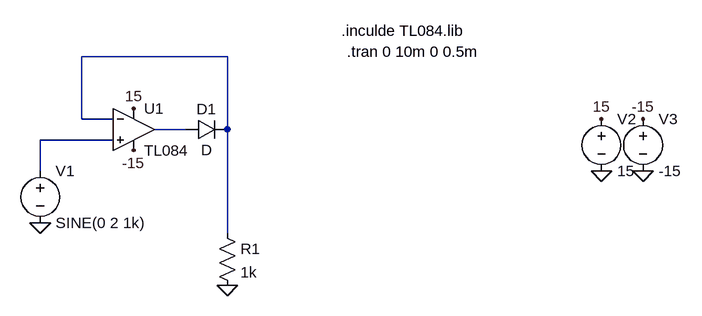
[diagram p0: schematic SuperDiode.asc]
SuperDiode.asc, the LTspice schematic file:
Version 4
SHEET 1 1072 680
WIRE 352 -48 128 -48
WIRE 128 48 128 -48
WIRE 176 48 128 48
WIRE 288 64 240 64
WIRE 352 64 352 -48
WIRE 176 80 64 80
WIRE 64 128 64 80
WIRE 352 224 352 64
FLAG 64 208 0
FLAG 928 128 0
FLAG 992 128 0
FLAG 208 32 15
FLAG 928 48 15
FLAG 208 96 -15
FLAG 992 48 -15
FLAG 352 304 0
SYMBOL voltage 64 112 R0
WINDOW 123 0 0 Left 0
WINDOW 39 0 0 Left 0
SYMATTR InstName V1
SYMATTR Value SINE(0 2 1k)
SYMBOL diode 288 80 R270
WINDOW 0 32 32 VTop 2
WINDOW 3 0 32 VBottom 2
SYMATTR InstName D1
SYMBOL Opamps\\opamp2 208 0 R0
SYMATTR InstName U1
SYMATTR Value TL084
SYMBOL voltage 928 32 R0
WINDOW 123 0 0 Left 0
WINDOW 39 0 0 Left 0
SYMATTR InstName V2
SYMATTR Value 15
SYMBOL voltage 992 32 R0
WINDOW 123 0 0 Left 0
WINDOW 39 0 0 Left 0
SYMATTR InstName V3
SYMATTR Value -15
SYMBOL res 336 208 R0
SYMATTR InstName R1
SYMATTR Value 1k
TEXT 536 -56 Left 2 !.tran 0 10m 0 0.5m
TEXT 528 -88 Left 2 !.inculde TL084.lib

The netlist it stands for:
* SuperDiode.asc
V1 N003 0 SINE(0 2 1k)
D1 N002 N001 D
XU1 N003 N001 15 -15 N002 TL084  ; pins In+ In- V+ V- OUT
V2 15 0 15
V3 -15 0 -15
R1 N001 0 1k
.model D D
.lib standard.dio
.tran 0 10m 0 0.5m
.inculde TL084.lib
.backanno
.end